# EAGLE design Piksey_Nano_A1 (EAGLE 9.0.1)
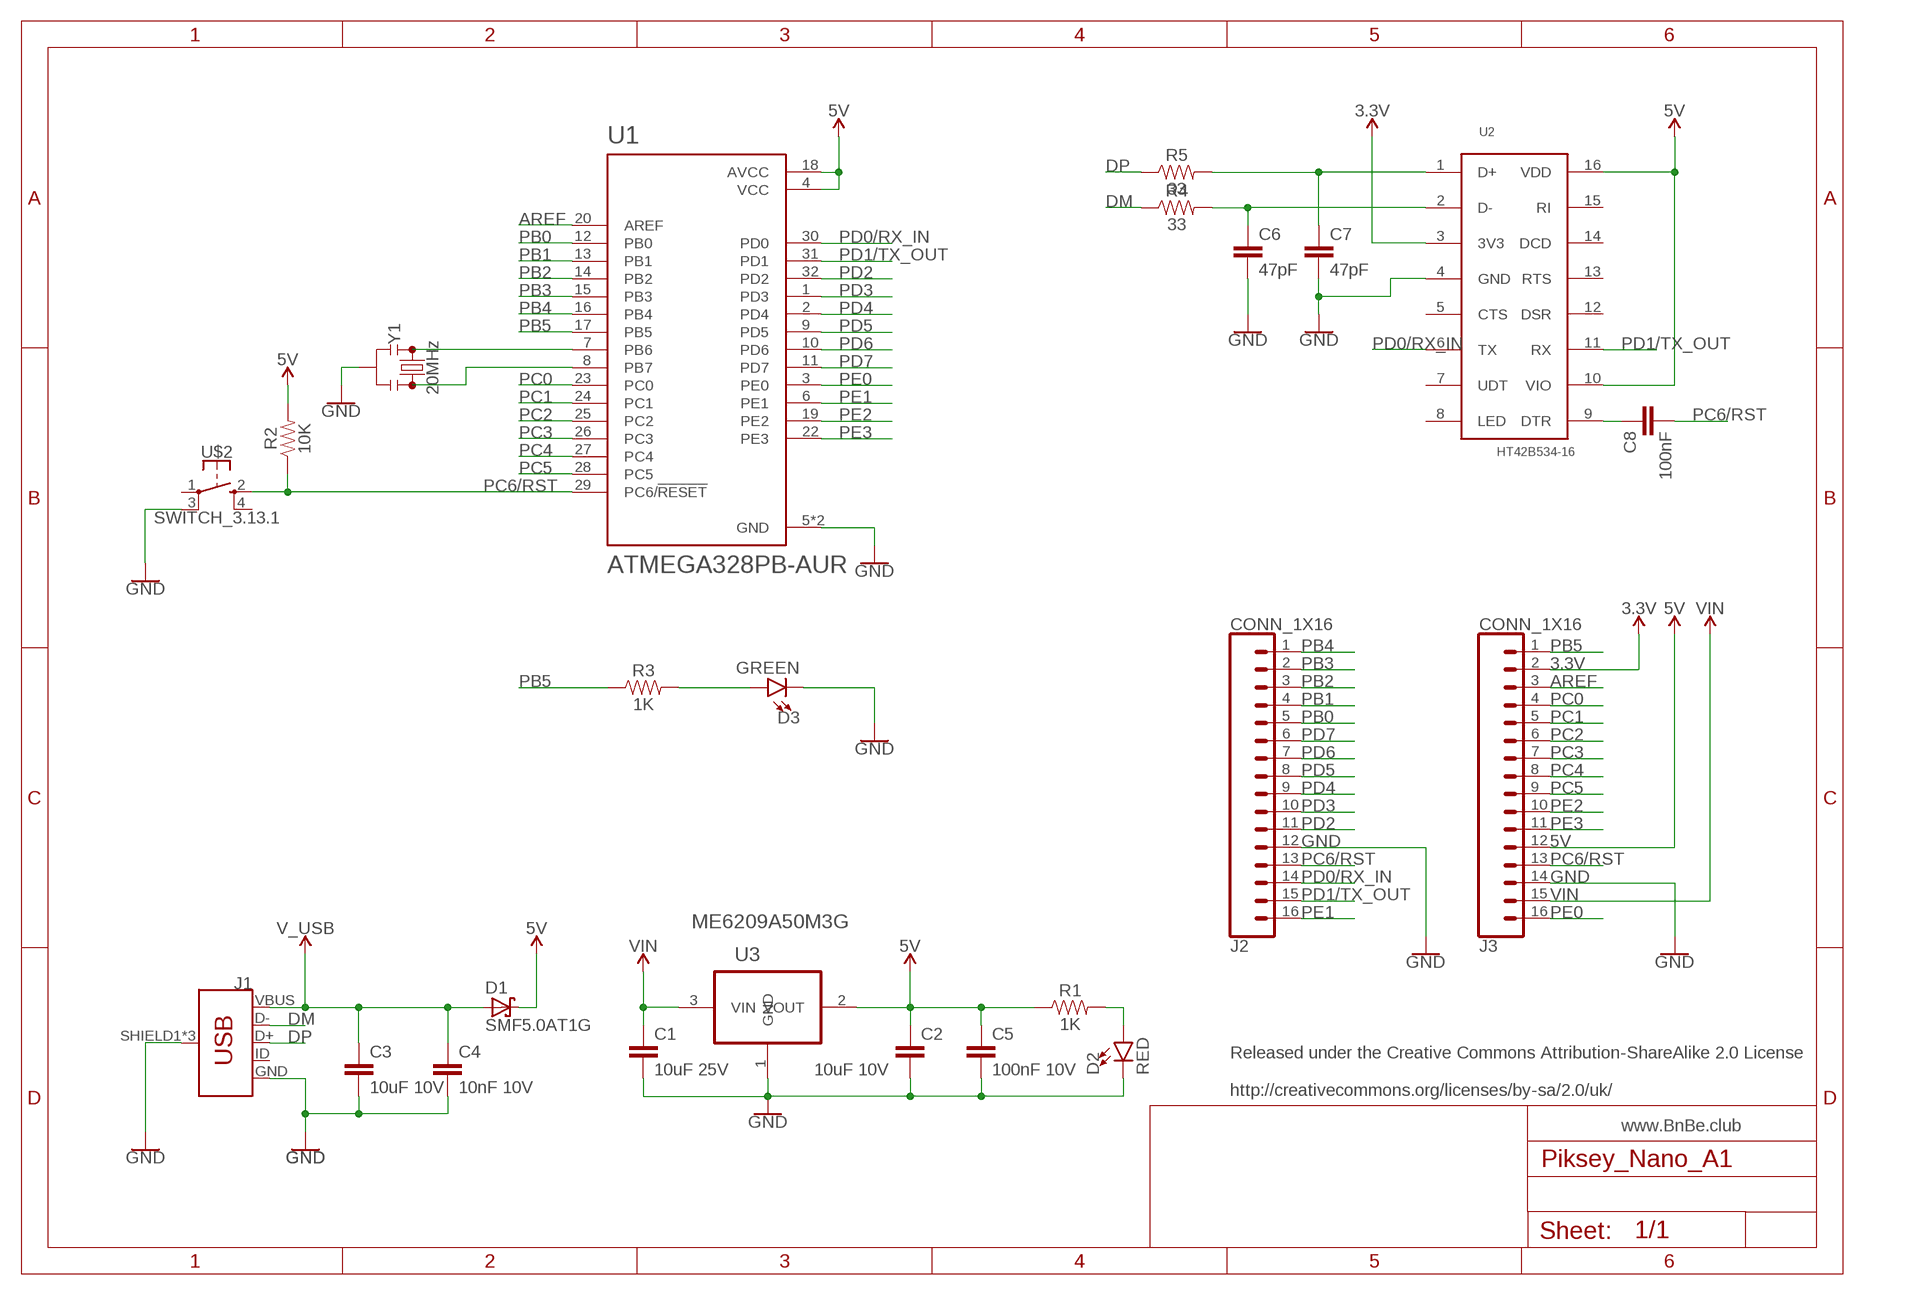
[diagram p0: schematic, sheet 1]

## Parts
C1  10uF 25V  10UF-0603-6.3V-20%  [0603]
C2  10uF 10V  100PF-0402-50V-5%  [0402]
C3  10uF 10V  100PF-0402-50V-5%  [0402]
C4  10nF 10V  100PF-0402-50V-5%  [0402]
C5  100nF 10V  100PF-0402-50V-5%  [0402]
C6  47pF  100PF-0402-50V-5%  [0402]
C7  47pF  100PF-0402-50V-5%  [0402]
C8  100nF  100PF-0402-50V-5%  [0402]
D1  SMF5.0AT1G  [SOD123FL]
D2  RED  LED0603  [LED-0603]
D3  GREEN  LED0603  [LED-0603]
J1  USB_MICRO-B_FEMALE-SMT  [USB-B-MICRO-SMD]
J2  CONN_1X16  [1X16]
J3  CONN_1X16  [1X16]
R1  1K  RESISTOR0402  [0402]
R2  10K  RESISTOR0402  [0402]
R3  1K  RESISTOR0402  [0402]
R4  33  RESISTOR0402  [0402]
R5  33  RESISTOR0402  [0402]
U1  ATMEGA328PB-AUR  [QFP80P900X900X120-32N]
U2  HT42B534-16  [NSOP-16]
U3  ME6209A50M3G  MCP1700T-3302E/TT  [SOT95P237X112-3N]
U$2  SWITCH_3.13.1  [SWITCH_3.1X3.1]
Y1  20MHz  RESONATOR-16MHZSMD_3.2X1.3  [RESONATOR-SMD-3.2X1.3]

## Nets
3.3V: J3.2 U2.3(3V3)
5V: C2.1 C5.1 D1.C J3.12 R1.1 R2.2 U1.4(VCC) U1.18(AVCC) U2.10(VIO) U2.16(VDD) U3.2(VOUT)
AREF: J3.3 U1.20(AREF)
DM: J1.D- R4.1
DP: J1.D+ R5.1
GND: C1.2 C2.2 C3.2 C4.2 C5.2 C6.2 C7.2 D2.C D3.C J1.GND J1.SHIELD1(SHIELD) J1.SHIELD2(SHIELD) J1.SHIELD3(SHIELD) J2.12 J3.14 U1.5(GND) U1.21(GND) U2.4(GND) U3.1(GND) U$2.3 Y1.2
N$2: C7.1 R5.2 U2.1(D+)
N$3: U1.7(PB6) Y1.1
N$4: C8.1 U2.9(DTR)
N$5: U1.8(PB7) Y1.3
N$6: D2.A R1.2
N$7: C6.1 R4.2 U2.2(D-)
N$9: D3.A R3.2
PB0: J2.5 U1.12(PB0)
PB1: J2.4 U1.13(PB1)
PB2: J2.3 U1.14(PB2)
PB3: J2.2 U1.15(PB3)
PB4: J2.1 U1.16(PB4)
PB5: J3.1 R3.1 U1.17(PB5)
PC0: J3.4 U1.23(PC0)
PC1: J3.5 U1.24(PC1)
PC2: J3.6 U1.25(PC2)
PC3: J3.7 U1.26(PC3)
PC4: J3.8 U1.27(PC4)
PC5: J3.9 U1.28(PC5)
PC6/RST: C8.2 J2.13 J3.13 R2.1 U1.29(PC6/!RESET) U$2.2
PD0/RX_IN: J2.14 U1.30(PD0) U2.6(TX)
PD1/TX_OUT: J2.15 U1.31(PD1) U2.11(RX)
PD2: J2.11 U1.32(PD2)
PD3: J2.10 U1.1(PD3)
PD4: J2.9 U1.2(PD4)
PD5: J2.8 U1.9(PD5)
PD6: J2.7 U1.10(PD6)
PD7: J2.6 U1.11(PD7)
PE0: J3.16 U1.3(PE0)
PE1: J2.16 U1.6(PE1)
PE2: J3.10 U1.19(PE2)
PE3: J3.11 U1.22(PE3)
V_USB: C3.1 C4.1 D1.A J1.VBUS
VIN: C1.1 J3.15 U3.3(VIN)
Unconnected: J1.ID U2.5(CTS) U2.7(UDT) U2.8(LED) U2.12(DSR) U2.13(RTS) U2.14(DCD) U2.15(RI) U$2.1 U$2.4

## Notes on the sheet
- Released under the Creative Commons Attribution-ShareAlike 2.0 License
  
  http://creativecommons.org/licenses/by-sa/2.0/uk/
- www.BnBe.club

## Library data of the parts
C1 = SparkFun-Capacitors:10UF: 10.0µF ceramic capacitors A capacitor is a passive two-terminal electrical component used to store electrical energy temporarily in an electric field.; PROD_ID: CAP-11015; VALUE: 10uF
C2-C8 = SparkFun-Capacitors:100PF: 100pF/0.1nF ceramic capacitors A capacitor is a passive two-terminal electrical component used to store electrical energy temporarily in an electric field.; PROD_ID: CAP-13458; VALUE: 100PF
D1 = SMF5.0AT1G:SMF5.0AT1G: 200 W Transient Voltage Suppressor Source: Data sheet <http://www.onsemi.com/pub_link/Collateral/SMF5.0AT1G-D.PDF>; AVAILABILITY: Warning; DESCRIPTION: Tvs Diode, 200w, 5v, Sod-123fl, Full Reel; MF: Littelfuse; MP: SMF5.0AT1G; PACKAGE: SOD-123 Littelfuse; PRICE: 0.17 USD
D2 D3 = SparkFun-LED:LED: LED (Generic) Standard schematic elements and footprints for 5mm, 3mm, 1206, and 0603 sized LEDs. Generic LEDs with no color specified.
J1 = SparkFun-Connectors:USB_MICRO-B: USB Type Micro-B Connector Male/female and PTH/SMT variants SparkFun Products: SparkFun microB USB Breakout <https://www.sparkfun.com/products/12035> SparkFun USB microB Plug Breakout <https://www.sparkfun.com/products/10031> SparkFun ESP8266 Thing <https://www.sparkfun.com/products/13231>; PROD_ID: CONN-11752
J2 J3 = Frenoy_Custom:CONN_1X16
R1-R5 = SparkFun-Resistors:RESISTOR: Generic Resistor Package
U1 = ATMEGA328PB-AUR:ATMEGA328PB-AUR: ATmega Series 20 MHz 32 KB Flash 2 KB SRAM 8-Bit Microcontroller - TQFP-32; AVAILABILITY: Good; DESCRIPTION: AVR microcontroller; EEPROM: 1024B; SRAM: 2kB; Flash: 32kB; TQFP32; MF: Microchip; MP: ATMEGA328PB-AUR; PACKAGE: TQFP-32 Microchip; PRICE: 1.36 USD
U2 = Frenoy_Custom:HT42B534-16
U3 = MCP1700T-3302E_TT:MCP1700T-3302E/TT: Low Quiescent Current LDO; AVAILABILITY: Good; DESCRIPTION: MCP1700 Series 250 mA 3.3 V Fixed Output LDO Voltage Regulator - SOT-23; MF: Microchip; MP: MCP1700T-3302E/TT; PACKAGE: SOT-23-3 Microchip; PRICE: 0.35 USD
U$2 = Frenoy_Custom:SWITCH_3.1*3.1
Y1 = SparkFun-Clocks:RESONATOR-16MHZ: 16MHz Resonator Digikey Example <http://www.digikey.com/product-detail/en/murata-electronics-north-america/CSTCE16M0V53-R0/490-1198-1-ND/584635> Frequency: 16MHz Frequency Stability: ±0.3% Frequency Tolerance: ±0.5% Capacitance: 15pF SparkFun Products SparkFun OpenLog <https://www.sparkfun.com/products/13712> SparkFun MicroView - OLED Arduino Module <https://www.sparkfun.com/products/12923>; PROD_ID: XTAL-08900; VALUE: 16MHz

## Board
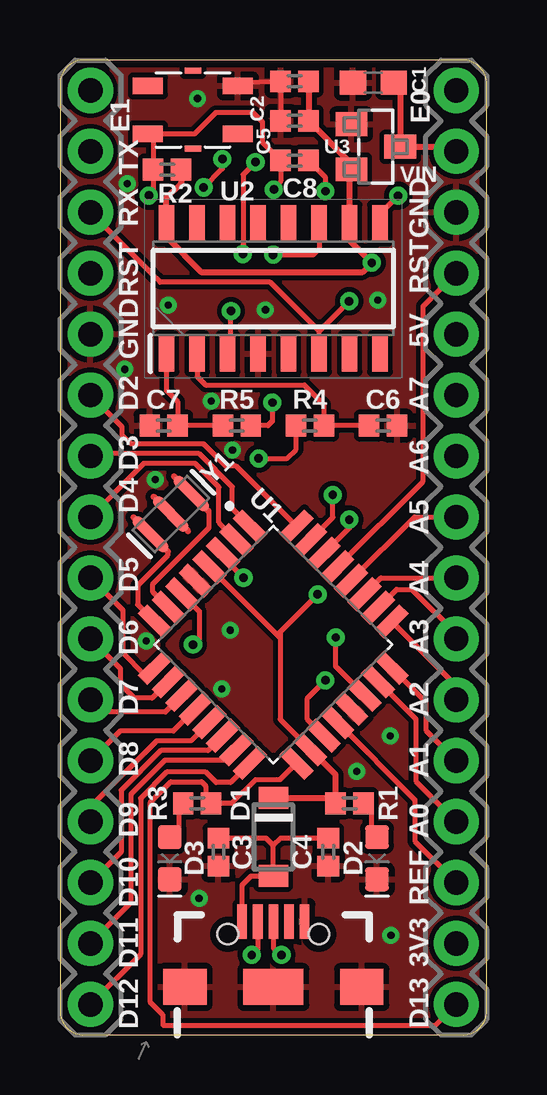
[diagram p1: board, top side]
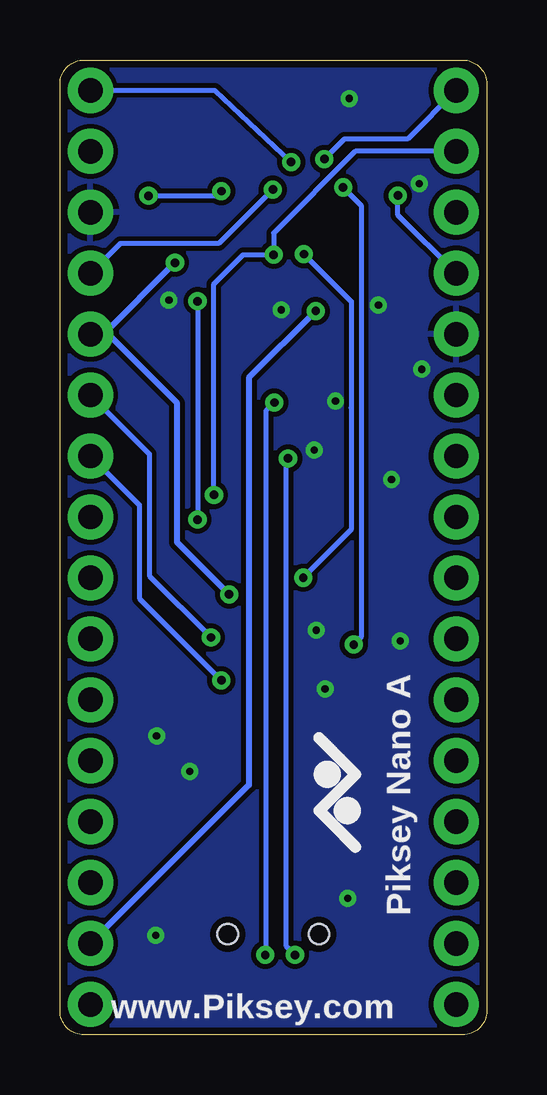
[diagram p2: board, bottom side, seen from below]

Size 17.78 x 40.64 mm. Coordinates in mm from the lower left corner, seen from the top.
Outline: 0,39.64 0,1 arc90 1,0 16.78,0 arc90 17.78,1 17.78,39.64 arc90 16.78,40.64 1,40.64 arc90 0,39.64
Copper layers (1*16): Top 0.035mm / dielectric 1.5mm / Bottom 0.035mm
Design rules "JLPCB_2L_Recommended_Use_this": minimum track width 8mil, minimum drill 0.3mm, track to track 8mil, track to pad 8mil, pad to pad 8mil, via to via 8mil, smd to smd 8mil, copper to edge 12mil, drill to drill 6mil, minimum pad ring 10mil, minimum via ring 8mil, stop-mask expansion 4mil, vias tented up to drill 20mil, thermal gap 10mil

### Footprints (pad centres in the part's own frame; a part is rotated, then mirrored left to right if it is on the bottom)
0603 = smd 1.1 x 1: 1 -0.85,0; 2 0.85,0
0402 = smd 0.85 x 0.9: 1 -0.58,0; 2 0.58,0
SOD123FL = smd 0.91 x 1.22: A 1.625,0; C -1.625,0
LED-0603 = smd 1 x 1: A -0.877,0; C 0.877,0
USB-B-MICRO-SMD = smd 1.45 x 0.4: D+ 2.725,0; D- 2.725,0.65; GND 2.725,-1.3; ID 2.725,-0.65; VBUS 2.725,1.3 | smd 1.5 x 1.8: SHIELD1 0,3.685; SHIELD2 0,-3.685 | smd 1.5 x 2.5: SHIELD3 0,0 | hole 0.85: 2.2,1.9; 2.2,-1.9
1X16 = drill 1.016 pad 1.88: 1 0,0; 2 2.54,0; 3 5.08,0; 4 7.62,0; 5 10.16,0; 6 12.7,0; 7 15.24,0; 8 17.78,0; 9 20.32,0; 10 22.86,0; 11 25.4,0; 12 27.94,0; 13 30.48,0; 14 33.02,0; 15 35.56,0; 16 38.1,0
QFP80P900X900X120-32N = smd 1.47 x 0.55: 1 -4.17,2.8; 2 -4.17,2; 3 -4.17,1.2; 4 -4.17,0.4; 5 -4.17,-0.4; 6 -4.17,-1.2; 7 -4.17,-2; 8 -4.17,-2.8; 17 4.17,-2.8; 18 4.17,-2; 19 4.17,-1.2; 20 4.17,-0.4; 21 4.17,0.4; 22 4.17,1.2; 23 4.17,2; 24 4.17,2.8 | smd 0.55 x 1.47: 9 -2.8,-4.17; 10 -2,-4.17; 11 -1.2,-4.17; 12 -0.4,-4.17; 13 0.4,-4.17; 14 1.2,-4.17; 15 2,-4.17; 16 2.8,-4.17; 25 2.8,4.17; 26 2,4.17; 27 1.2,4.17; 28 0.4,4.17; 29 -0.4,4.17; 30 -1.2,4.17; 31 -2,4.17; 32 -2.8,4.17
NSOP-16 = smd 1.525 x 0.65: 1 -2.712,4.445; 2 -2.712,3.175; 3 -2.712,1.905; 4 -2.712,0.635; 5 -2.712,-0.635; 6 -2.712,-1.905; 7 -2.712,-3.175; 8 -2.712,-4.445; 9 2.712,-4.445; 10 2.712,-3.175; 11 2.712,-1.905; 12 2.712,-0.635; 13 2.712,0.635; 14 2.712,1.905; 15 2.712,3.175; 16 2.712,4.445
SOT95P237X112-3N = smd 0.991 x 1.321: 1 -0.94,-1.016; 2 0.94,-1.016; 3 0,1.016
SWITCH_3.1X3.1 = smd 1.25 x 0.7: 1 -1.875,1; 2 -1.875,-1; 3 1.875,1; 4 1.875,-1 | smd 0.7 x 0.25: P$5 0,1.625; P$6 0,-1.625
RESONATOR-SMD-3.2X1.3 = smd 0.45 x 1.905: 1 -1.2,0; 2 0,0; 3 1.2,0

### Placement (x,y rotation side)
C1  13.06,39.7 180 top
C2  9.78,39.75 180 top
C3  6.6,7.62 270 top
C4  11.18,7.62 270 top
C5  9.78,38.1 180 top
C6  13.46,25.4 0 top
C7  4.32,25.4 180 top
C8  9.78,36.45 180 top
D1  8.89,8.26 270 top
D2  13.21,7.37 270 top
D3  4.57,7.37 270 top
J1  8.89,2 90 top
J2  1.27,1.27 90 top
J3  16.51,1.27 90 top
R1  12.06,9.65 0 top
R2  4.46,36.07 0 top
R3  5.71,9.65 180 top
R4  10.41,25.4 0 top
R5  7.37,25.4 180 top
U1  8.89,16.27 315 top
U2  8.89,31.11 90 top
U3  13.16,37.02 270 top
U$2  5.54,38.56 0 top
Y1  4.62,21.71 225 top

### Tracks (layer width: path | path; a pad name or v marks a point on that pad's centre or on a via)
3.3V  (via drill 0.35)
  Top 0.203: v7.12,30.18 7.12,28.53 U2.3
  Bottom 0.254: v7.12,30.18 9.91,27.39 9.91,10.41 J3.2
5V  (via drill 0.35)
  Top 0.203: 12.04,34.09 U2.10 | 4.41,34.1 U2.16 | 11.48,9.69 R1.1 | U1.18 9.18,13.15 9.18,16.55 | v10.73,18.36 9.18,16.8 9.18,16.55 | U1.4 9.18,16.55
  Top 0.254: U2.16 4.44,33.82 4.44,33.25 5.88,31.81 12.61,31.81 v12.99,32.19 12.06,33.11 U2.10 12.06,36 U3.2 12.04,36.41 C5.1 C2.1 | R2.2 5.04,35.51 4.41,34.88 4.41,34.1 | D1.C 11.3,9.88 11.48,9.69 | R1.1 11.48,10.84 U1.18
  Bottom 0.254: v10.73,18.36 12.9,20.53 12.9,26.33 15.78,29.21 J3.12 15.96,29.21 v12.99,32.19
AREF
  Top 0.203: U1.20 14.79,9.8 14.79,8.07 J3.3
DM  (via drill 0.35)
  Top 0.203: J1.D- 8.24,3.58 v7.99,3.33 | v8.28,24.03 9.46,24.03 9.84,24.41 9.83,24.41 R4.1
  Bottom 0.203: v7.99,3.33 8.35,3.69 8.35,23.96 v8.28,24.03
DP  (via drill 0.35)
  Top 0.203: J1.D+ 8.89,3.62 9.23,3.29 | 9.24,3.27 9.23,3.29 | 9.23,3.29 v9.23,3.33 | v8.85,26.36 8.85,25.59 8.66,25.4 R5.1
  Bottom 0.203: 9.21,3.35 v9.23,3.33 9.18,3.38 9.18,26.04 v8.86,26.36 v8.85,26.36
GND  (via drill 0.3)
  Top 0.203: J1.SHIELD2 | U$2.3 7.45,39.67 C2.2 C5.2
  other vias: 7.19,24.38 2.7,27.75 6.74,14.42 3.6,16.42 13.79,4.15 4.51,30.42 13.76,12.47 3.97,23.15 7.1,16.87 5.79,5.7 12.37,10.99 5.73,39.03 13.24,30.63 8.56,30.22 6.3,26.42 2.81,35.48
  pour Top (isolate 0.203): -0.4,20.4 -0.22,39.02 arc-89 1.78,41 17,41 arc-90 18,40 18,-0.2 0.6,-0.2 arc-90 -0.4,0.8
  pour Bottom (isolate 0.203): -0.46,41.99 16.72,41.99 arc-90 17.72,40.99 17.78,0.8 arc-90 16.78,-0.2 -0.09,-0.2 arc-91 -1.09,0.81 -0.92,20.67
N$2
  Top 0.203: R5.2 C7.1 4.9,26.4 4.45,26.85 U2.1
N$3
  Top 0.203: U1.7 3.87,18.45 3.87,18.8 5.85,20.77 6.21,21.14 6.21,21.83 Y1.1
N$4  (via drill 0.35)
  Top 0.203: 13.54,34.03 U2.9 13.34,34.23 v14.09,34.98 | C8.1 11.06,35.75 v11.06,35.17
  Bottom 0.203: v14.09,34.98 11.25,34.98 v11.06,35.17
N$5
  Top 0.203: U1.8 3.94,17.24 3.23,17.94 3.23,18.74 4.49,19.99 4.49,20.15 Y1.3
N$6
  Top 0.203: 12.84,8.64 12.97,8.5 | 12.97,8.5 D2.A | R1.2 12.97,9.33 12.97,8.5
N$7
  Top 0.203: 12.87,25.68 C6.1 11.12,25.4 11.11,25.42 R4.2 11,26.28 10.18,27.09 6.06,27.09 5.71,27.44 U2.2
N$9
  Top 0.203: R3.2 4.94,9.46 4.94,8.61 D3.A
PB0
  Top 0.203: U1.12 4.72,12.67 2.51,12.67 J2.5
PB1
  Top 0.203: U1.13 5.45,12.26 4.03,12.26 1.27,9.5 J2.4
PB2
  Top 0.203: U1.14 6.17,11.85 4.2,11.85 2.55,10.2 2.55,7.63 J2.3
PB3
  Top 0.203: U1.15 6.9,11.45 4.37,11.45 2.95,10.03 2.95,5.49 J2.2
PB4
  Top 0.203: 7.47,10.89 U1.16 7.11,10.52 6.5,10.52 6.07,10.96 4.45,10.96 3.36,9.87 3.36,3.36 J2.1
PB5
  Top 0.203: 6.05,9.85 R3.1 | U1.17 9.16,10.64 8.15,10.64 7.17,9.65 R3.1 | R3.1 6.07,9.87 6.07,10.38 5.9,10.55 4.62,10.55 3.77,9.7 3.77,1.36 4.29,0.83 4.29,0.41 15.65,0.41 J3.1
PC0
  Top 0.203: U1.23 14.82,13.16 14.82,10.57 J3.4
PC1
  Top 0.203: U1.24 15.25,13.87 15.25,12.69 J3.5
PC2
  Top 0.203: U1.25 16.51,14.54 J3.6
PC3
  Top 0.203: U1.26 14.03,18.57 14.66,18.57 16.51,16.73 J3.7
PC4
  Top 0.203: U1.27 13.37,19.05 J3.8
PC5
  Top 0.203: U1.28 14.78,21.59 J3.9
PC6/RST  (via drill 0.35)
  Top 0.203: U1.29 15.13,23.08 15.13,30.37 J3.13 | v8.91,35.24 9.2,35.58 C8.2 8.45,37.2 8.45,38.05 8.04,38.45 6.5,38.45 5.59,37.55 U$2.2 3.88,37.46 R2.1 3.88,35.17 v3.7,34.99
  Bottom 0.203: J3.13 15.27,32.99 11.17,32.99 v8.91,35.24 | v3.7,34.99 3.7,34.18 J2.13
PD0/RX_IN  (via drill 0.35)
  Top 0.203: v12.05,21.48 12.05,21.13 U1.30 | U2.6 10.79,29.33 | 10.79,29.33 v12.05,30.58 | J2.14 3.81,31.75 3.81,31.74 4.18,31.37 8.76,31.37 10.79,29.33
  Bottom 0.203: v12.05,30.58 v12.05,21.48
PD1/TX_OUT  (via drill 0.35)
  Top 0.203: U1.31 11.37,21.57 v11.37,22.51 | U2.11 10.79,32.77 10.54,32.51 8.89,32.51 v8.88,32.52
  Bottom 0.203: v11.37,22.51 11.37,31.3 10.14,32.52 v8.88,32.52 8.88,33.42 5.47,36.83 J2.15
PD2
  Top 0.203: U1.32 7.34,23.71 6.9,23.71 5.98,24.63 2.96,24.63 2.58,25.01 2.58,25.36 J2.11
PD3
  Top 0.203: U1.1 7.18,21.93 7.18,22.84 5.8,24.22 1.36,24.22 J2.10
PD4
  Top 0.203: J2.9 2.13,22.45 2.13,22.46 3.49,23.82 5.63,23.82 6.62,22.83 6.62,21.37 U1.2
PD5
  Top 0.203: J2.8 2.63,17.69 2.63,15.91 3.54,15.01 3.83,15.3 U1.9
PD6
  Top 0.203: U1.10 3.84,14.04 3.09,14.04 2.52,14.61 2.52,15.26 J2.7
PD7
  Top 0.203: U1.11 4.38,13.46 1.78,13.46 J2.6
PE0  (via drill 0.35)
  Top 0.203: U1.3 6.79,19.91 v7.64,19.06 | v8.15,36.38 7.62,35.86 7.62,32.94 | 7.62,32.94 | 7.62,32.94 v7.62,32.55
  Bottom 0.203: J3.16 11.34,39.37 v8.15,36.38 | v7.62,32.55 5.9,30.82 5.64,30.57 5.64,26.14 5.64,21.06 v7.64,19.06
PE1  (via drill 0.35)
  Top 0.203: 5.61,16.27 5.59,16.27 | 5.59,16.27 v5.54,16.27 | U1.6 5.8,17.66 5.8,16.48 5.59,16.27 | v5.99,35.33 6.77,36.11 v6.77,36.51
  Bottom 0.203: J2.16 3.29,37.34 5.93,37.34 v6.77,36.51 | v5.99,35.33 5.24,34.58 5.24,16.58 v5.54,16.27
PE2  (via drill 0.35)
  Top 0.203: U1.19 10.3,13.15 10.3,14.03 v11.05,14.78
  Bottom 0.203: 11.09,14.7 v11.05,14.78 14.47,18.2 14.47,22.09 J3.10
PE3  (via drill 0.35)
  Top 0.203: U1.22 11.49,15.37 v11.49,16.57
  Bottom 0.203: J3.11 14.05,24.21 14.05,19.14 v11.49,16.57
V_USB
  Top 0.203: 8.88,6.32 D1.A | D1.A 8.89,7.9 | C3.1 8.59,8.2 8.89,7.9 | C4.1 9.19,8.2 8.89,7.9 | J1.VBUS 7.59,6.25 7.97,6.62 D1.A
VIN
  Top 0.254: C1.1 14.17,39.43 U3.3 16.32,37.02 J3.15

### Text on the board
bPlace: Piksey Nano A | www.Piksey.com
tNames: E1 | E0 | TX | VIN | RX | GND | RST | RST | 5V | GND | D2 | A7 | D3 | A6 | D4 | A5 | D5 | A4 | D6 | A3 | D7 | A2 | D8 | A1 | D9 | A0 | D10 | REF | D11 | 3V3 | D12 | D13